# EasyEDA Pro project SDBlocker.eprj

# Schematic Schematic1
Board Name: Board1; Create Date: 2026-04-04; Page Name: P1; Project Name: SDBlocker; Schematic Name: Schematic1; Update Date: 2026-07-10; Company: EasyEDA.com; Page Size: A4; Version: V1.0
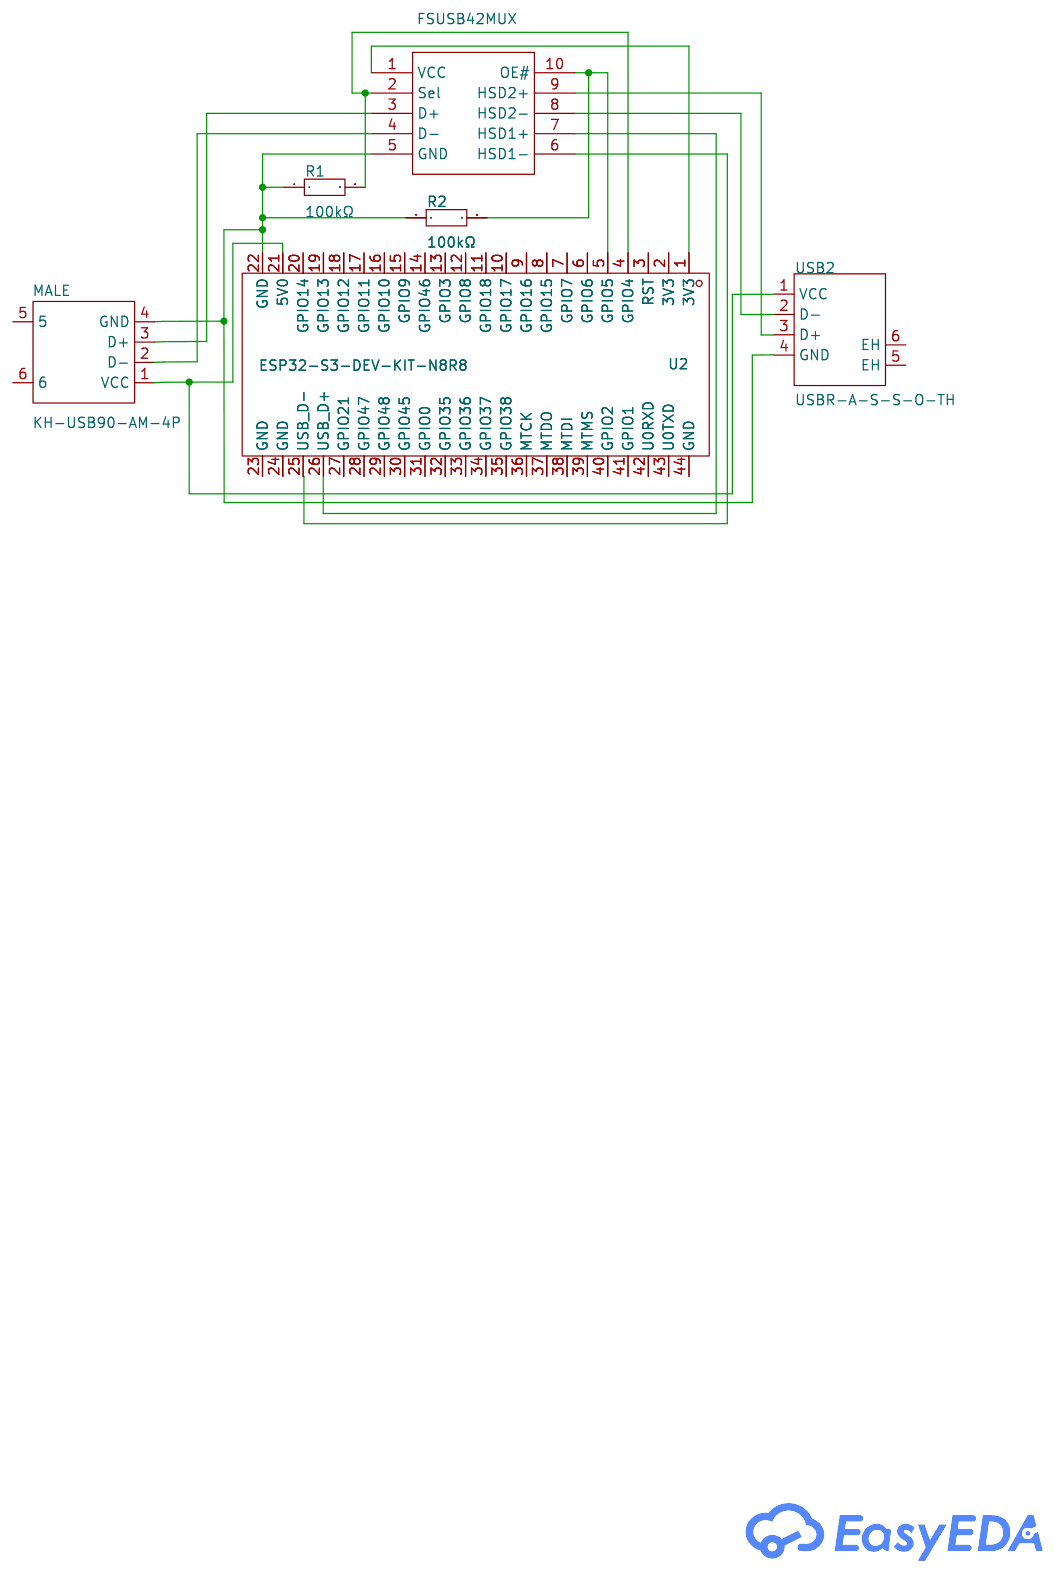
[diagram p0: schematic sheet]

## Parts
FSUSB42MUX  FSUSB42MUX  [MSOP-10_L3.0-W3.0-P0.50-LS5.0-BL]
MALE  KH-USB90-AM-4P  [USB-A-TH_917-181A202ED60201]
R1  100kΩ  [R1206]
R2  100kΩ  [R1206]
U2  ESP32-S3-DEV-KIT-N8R8  [COMM-TH_L63.3-W25.4-P2.54-LS22.86]
USB2  USBR-A-S-S-O-TH  [USB-TH_USBR-A-S-S-O-TH]

## Library data of the parts
FSUSB42MUX = FSUSB42MUX: Switch Circuit:2:1 Number of Channels:2 Ron:3.9Ω Voltage - Supply:3V~4.4V Voltage - Supply:3V~4.4V Con:3.7pF Turn-on time:13ns Turn-off time:12ns Bandwidth:720MHz Operating Temperature:-40℃~+85℃ Operating Temperature:-40℃~+85℃ Propagation Delay (tpd):250p; LCSC Part Name: 低功耗，双端口，高速USB2.0 (480Mbps) UART开关; Supplier Part: C11355; Manufacturer: onsemi(安森美); Supplier Footprint: MSOP-10; JLCPCB Part Class: Extended Part; Datasheet: https://item.szlcsc.com/datasheet/FSUSB42MUX/11908.html; Supplier: LCSC; Switch Circuit: 2:1; Number of Channels: 2; Supply Voltage: 3V~4.4V; Turn-on time: 13ns; On-State Resistance (Max): 6.5Ω; Turn-off time: 12ns; Operating Temperature: -40℃~+85℃; Ron: 3.9Ω; Voltage - Supply: 3V~4.4V; Con: 3.7pF; Bandwidth: 720MHz; Propagation Delay (tpd): 250ps; Features: Bidirectional analog channel；Fault protection
MALE = KH-USB90-AM-4P: Connector Type:Type-A Protocol Standard:USB 2.0 Gender:Male Mounting Type:Right Angle Number of Contacts:4P Number of Ports:1 Current Rating-Power:- Length:18.8mm Operating Temperature:- Operating Temperature:-; LCSC Part Name: Type-A 公 弯插; Supplier Part: C2828093; Manufacturer: kinghelm(金航标); Supplier Footprint: 弯插; JLCPCB Part Class: Extended Part; Datasheet: https://item.szlcsc.com/datasheet/KH-USB90-AM-4P/2975545.html; Supplier: LCSC; Connector Type: Type-A; Protocol Standard: USB 2.0; Gender: Male; Mounting Type: Right Angle; Number of Contacts: 4P; Number of Ports: 1; Length: 18.8mm
R1 R2 = CR1206J100KP05Z: Type:Thick Film Resistor Resistance:100kΩ Tolerance:±5% Tolerance:±5% Power(Watts):250mW Voltage-Supply(Max):200V Temperature Coefficient:±100ppm/℃ Temperature Coefficient:±100ppm/℃ Operating Temperature:-55℃~+155℃ Operating Temperature:-55℃~+155℃; LCSC Part Name: 厚膜电阻 100kΩ ±5% 250mW; Supplier Part: C881326; Manufacturer: EVER OHMS(天二科技); Supplier Footprint: 1206; JLCPCB Part Class: Extended Part; Datasheet: https://item.szlcsc.com/datasheet/CR1206J100KP05Z/944241.html; Supplier: LCSC; Type: Thick Film Resistor; Tolerance: ±5%; Power(Watts): 250mW; Voltage-Supply(Max): 200V; Temperature Coefficient: ±100ppm/℃; Operating Temperature: -55℃~+155℃
U2 = ESP32-S3-DEV-KIT-N8R8: Supplier Part: C9900170771; Supplier Footprint: SMD; Supplier: LCSC
USB2 = USBR-A-S-S-O-TH: LCSC Part Name: Type-A 母 弯插; Supplier Part: C3197997; Manufacturer: SAMTEC; Supplier Footprint: 插件; JLCPCB Part Class: Extended Part; Datasheet: https://item.szlcsc.com/datasheet/USBR-A-S-S-O-TH/3759758.html; Supplier: LCSC; Connector Type: Type-A; Protocol Standard: USB 2.0; Gender: Female; Mounting Type: Right Angle; Number of Contacts: 4P; Number of Ports: 1; Voltage Rating: 30V; Detection color: Orange; Operating Temperature: -50℃~+85℃

## Nets
$1N2770: FSUSB42MUX.3(D+) MALE.3(D+)
$1N2815: FSUSB42MUX.4(D-) MALE.2(D-)
$1N2926: FSUSB42MUX.1(VCC) U2.1(3V3)
$1N3122: FSUSB42MUX.6(HSD1-) U2.25(USB_D-)
$1N3580: FSUSB42MUX.2(Sel) R1.2 U2.4(GPIO4)
$1N3681: FSUSB42MUX.10(OE#) R2.2 U2.5(GPIO5)
Net-(FSUSB42MUX-5): FSUSB42MUX.5(GND) MALE.4(GND) R1.1 R2.1 U2.22(GND)

Not connected (* = marked no-connect by the designer): FSUSB42MUX 7(HSD1+) 8(HSD2-) 9(HSD2+); MALE 1(VCC) 5 6; U2 2(3V3) 3(RST) 6(GPIO6) 7(GPIO7) 8(GPIO15) 9(GPIO16) 10(GPIO17) 11(GPIO18) 12(GPIO8) 13(GPIO3) 14(GPIO46) 15(GPIO9) 16(GPIO10) 17(GPIO11) 18(GPIO12) 19(GPIO13) 20(GPIO14) 21(5V0) 23(GND) 24(GND) 26(USB_D+) 27(GPIO21) 28(GPIO47) 29(GPIO48) 30(GPIO45) 31(GPIO0) 32(GPIO35) 33(GPIO36) 34(GPIO37) 35(GPIO38) 36(MTCK) 37(MTDO) 38(MTDI) 39(MTMS) 40(GPIO2) 41(GPIO1) 42(U0RXD) 43(U0TXD) 44(GND); USB2 1(VCC) 2(D-) 3(D+) 4(GND) 5(EH) 6(EH)

# Board PCB1
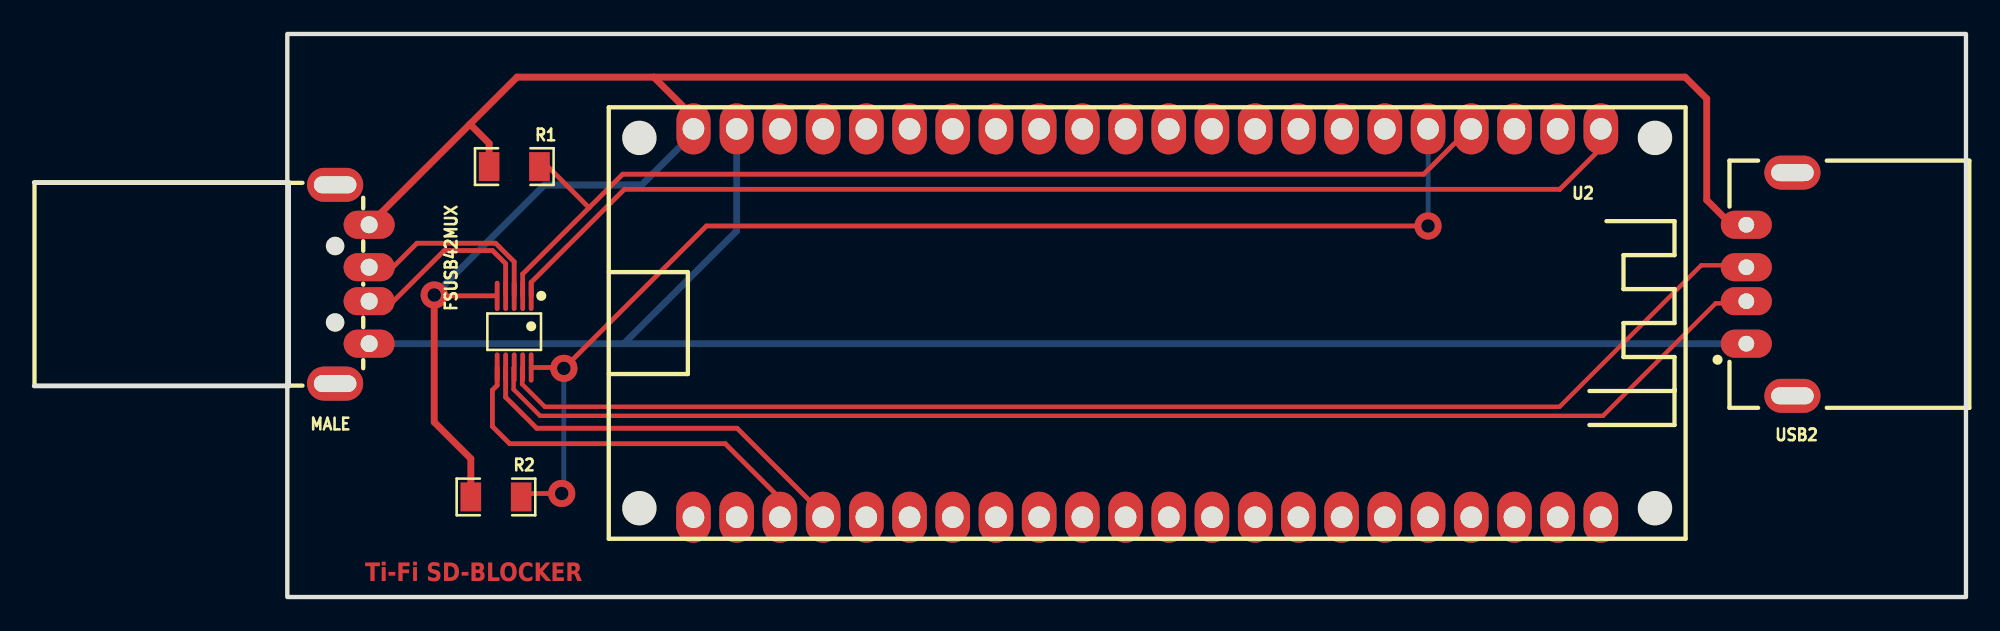
[diagram p1: board, top side]
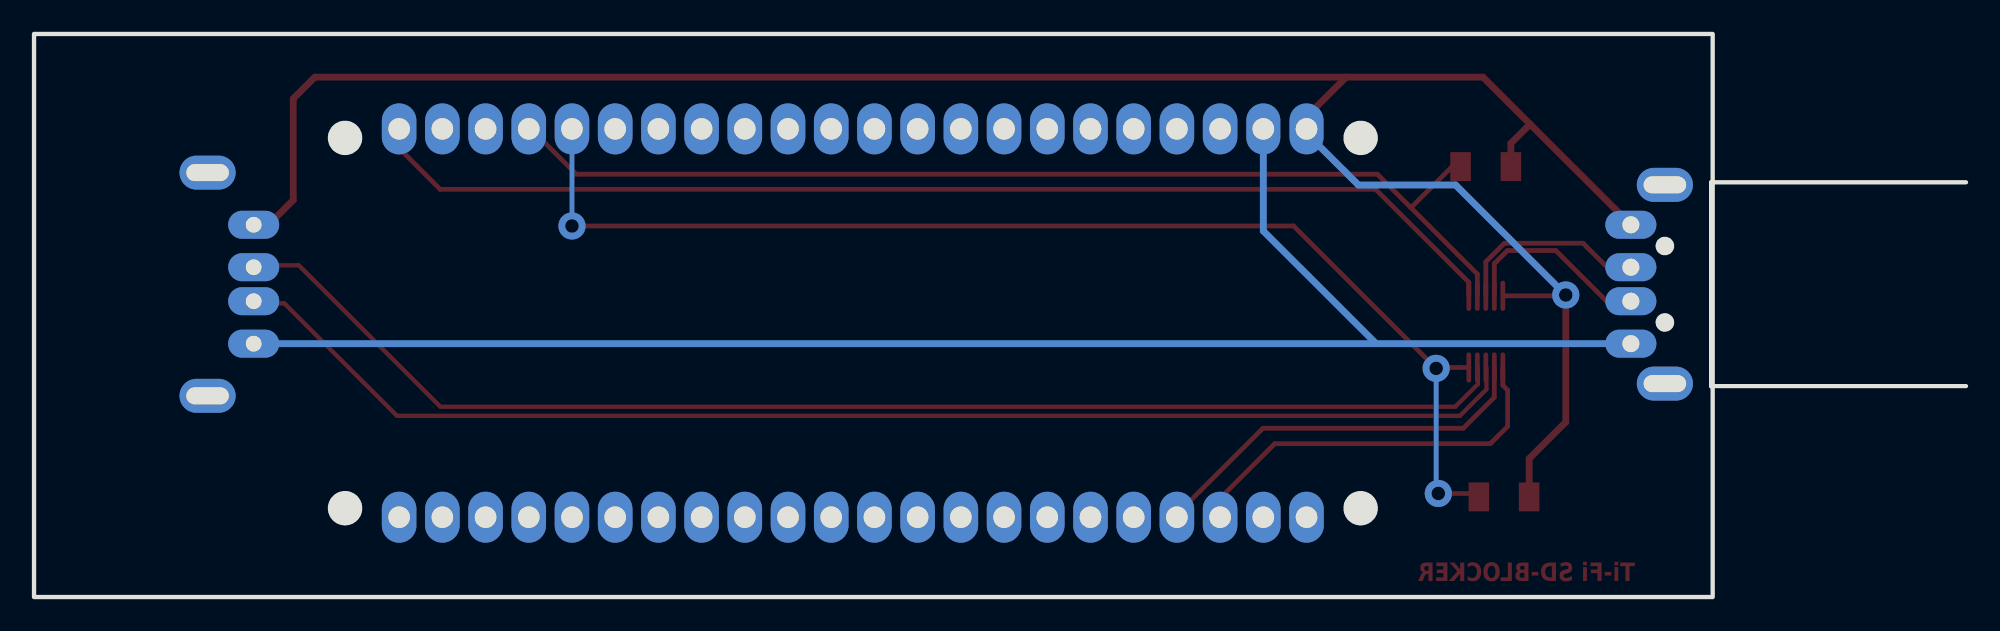
[diagram p2: board, bottom side, seen from below]

Outline 113.57 x 33.15 mm; copper layers: Top Layer, Bottom Layer. Coordinates in mm from the lower left corner of the outline.
Outline path: rectangle 14.89,33.15 113.57,0
Stack: Top Layer 0.035mm / Dielectric1 1.51mm FR4 er 4.5 / Bottom Layer 0.035mm

## Design rules (mm)
net $1N2770: DP1
net $1N2815: DP1
net $1N3095: DP3
net $1N3264: DP3
net $1N3111: DP2
net $1N3122: DP2
template: Custom Config
spacing copperThickness1oz (default): track to track 0.2, other pairs 0.2 to 0.2
spacing copperThickness2oz: track to track 0.203, other pairs 0.152 to 0.3
track width copperThickness1oz (default): min 0.127, default 0.254, max 2.54
track width copperThickness2oz: min 0.203, default 0.254, max 2.54
differential pair differentialPair (default): width min 0.127, default 0.254, max 2.54; gap min 0.152, default 0.152
via viaSize (default): diameter min 0.5, default 0.61, max 10; hole min 0.3, default 0.305, max 6.3

## Placement (name value [footprint] x y rotation side)
FSUSB42MUX  FSUSB42MUX  [MSOP-10_L3.0-W3.0-P0.50-LS5.0-BL]  28.22 15.62 180 top
MALE  KH-USB90-AM-4P  [USB-A-TH_917-181A202ED60201]  18.7 18.42 270 top
R1  100kΩ  [R1206]  28.23 25.34 0 top
R2  100kΩ  [R1206]  27.16 5.89 0 top
U2  ESP32-S3-DEV-KIT-N8R8  [COMM-TH_L63.3-W25.4-P2.54-LS22.86]  65.44 16.13 270 top
USB2  USBR-A-S-S-O-TH  [USB-TH_USBR-A-S-S-O-TH]  102.01 18.42 90 top

## Footprints (pads in the part's own frame, mm; a bottom-side part is the same pattern mirrored in y, then rotated)
COMM-TH_L63.3-W25.4-P2.54-LS22.86
  oval 3x2.032 hole 1.27: 1(-11.43,26.67) 2(-11.43,24.13) 3(-11.43,21.59) 4(-11.43,19.05) 5(-11.43,16.51) 6(-11.43,13.97) 7(-11.43,11.43) 8(-11.43,8.89) 9(-11.43,6.35) 10(-11.43,3.81) 11(-11.43,1.27) 12(-11.43,-1.27) 13(-11.43,-3.81) 14(-11.43,-6.35) 15(-11.43,-8.89) 16(-11.43,-11.43) 17(-11.43,-13.97) 18(-11.43,-16.51) 19(-11.43,-19.05) 20(-11.43,-21.59) 29(11.43,-11.43) 30(11.43,-8.89) 31(11.43,-6.35) 32(11.43,-3.81) 33(11.43,-1.27) 34(11.43,1.27) 35(11.43,3.81) 36(11.43,6.35) 37(11.43,8.89) 38(11.43,11.43) 39(11.43,13.97) 40(11.43,16.51) 41(11.43,19.05) 42(11.43,21.59) 43(11.43,24.13) 44(11.43,26.67)
  oval 3x2 hole 1.27: 21(-11.43,-24.13) 22(-11.43,-26.67)
  oval 3x2.032 hole 1.27x1.143: 23(11.43,-26.67) 24(11.43,-24.13) 25(11.43,-21.59) 26(11.43,-19.05) 27(11.43,-16.51) 28(11.43,-13.97)
MSOP-10_L3.0-W3.0-P0.50-LS5.0-BL
  oval 0.28x1.778 smd: 1(-1,-2.11) 2(-0.5,-2.11) 3(0,-2.11) 4(0.5,-2.11) 5(1,-2.11) 6(1,2.11) 7(0.5,2.11) 8(0,2.11) 9(-0.5,2.11) 10(-1,2.11)
R1206
  rect 1.208x1.701 smd: 1(-1.479,0) 2(1.479,0)
USB-A-TH_917-181A202ED60201
  oval 1.651x3 hole 1: 1(3.5,1) 2(1,1) 3(-1,1) 4(-3.5,1)
  oval 2x3.3 hole 1x2.5: 5(-5.85,-1) 6(5.85,-1)
USB-TH_USBR-A-S-S-O-TH
  oval 1.651x3 hole 0.925x0.92: 1(-3.5,1.355) 2(-1,1.355) 3(1,1.355) 4(3.5,1.355)
  oval 1.999x3.3 hole 1.001x2.499: 5(-6.57,-1.355) 6(6.57,-1.355)

## Nets
$1N2770: FSUSB42MUX.3 MALE.3
$1N2815: FSUSB42MUX.4 MALE.2
$1N2863: MALE.1 U2.21 USB2.1
$1N2926: FSUSB42MUX.1 U2.1
$1N3095: FSUSB42MUX.8 USB2.2
$1N3111: FSUSB42MUX.7 U2.26
$1N3122: FSUSB42MUX.6 U2.25
$1N3264: FSUSB42MUX.9 USB2.3
$1N3580: FSUSB42MUX.2 R1.2 U2.4
$1N3681: FSUSB42MUX.10 R2.2 U2.5
$1N5589: FSUSB42MUX.5 MALE.4 R1.1 R2.1 U2.22 USB2.4

Pads without a net: MALE 5 6; U2 2 3 6 7 8 9 10 11 12 13 14 15 16 17 18 19 20 23 24 27 28 29 30 31 32 33 34 35 36 37 38 39 40 41 42 43 44; USB2 5 6

## Via types
v1: diameter 1.6, hole 0.8, Top Layer to Bottom Layer, 4 vias

## Routing (per net, layer and track width the routed paths; a pad name or vN(x,y) marks a point on that pad's centre or on a via; arc(x,y) is an arc through that point)
$1N2770: length 11.6
  Top Layer w0.28: MALE.3 21.1,19.42 22.51,20.83 27.13,20.83 28.22,19.74 FSUSB42MUX.3
$1N2815: length 11.5
  Top Layer w0.28: FSUSB42MUX.4 27.72,19.63 26.95,20.4 24.11,20.4 21.13,17.42 MALE.2
$1N2863: length 96.3
  Bottom Layer w0.399: 34.67,14.92 USB2.1 ; 34.67,14.92 41.31,21.55 U2.21 ; 34.67,14.92 MALE.1
$1N2926: length 68.1
  Top Layer w0.28: FSUSB42MUX.1 29.22,18.53 34.7,24 89.69,24 92.11,26.42 U2.1
$1N3095: length 77.2
  Top Layer w0.254: FSUSB42MUX.8 28.19,13.48 28.19,12.23 29.75,10.67 92.23,10.67 98.85,17.29 99.51,17.29 99.64,17.42 USB2.2
$1N3111: length 23.4
  Top Layer w0.28: U2.26 46.39,4.88 41.33,9.93 29.55,9.93 27.72,11.76 FSUSB42MUX.7
$1N3122: length 23.5
  Top Layer w0.28: U2.25 43.98,4.84 43.98,5.68 40.63,9.03 27.96,9.03 26.95,10.04 26.95,12.18 27.22,12.46 FSUSB42MUX.6
$1N3264: length 77
  Top Layer w0.254: USB2.3 100.54,19.53 98,19.53 89.68,11.2 30.03,11.2 28.69,12.53 28.69,13.48 FSUSB42MUX.9
$1N3580: length 64.5
  Top Layer w0.28: 32.63,22.92 28.72,19.02 FSUSB42MUX.2 ; 32.63,22.92 34.6,24.89 81.69,24.89 84.36,27.56 U2.4 ; 32.63,22.92 30.21,25.34 R1.2
$1N3681: length 71.1
  Top Layer w0.28: FSUSB42MUX.10 31.1,13.51 v1(31.15,13.46) 39.53,21.84 v1(81.95,21.84) ; v1(31.02,6.1) 29.23,6.1
  Bottom Layer w0.28: v1(31.02,6.1) 31.15,6.22 v1(31.15,13.46) ; v1(81.95,21.84) U2.5
$1N5589: length 134.5
  Top Layer w0.28: 27.14,17.73 23.58,17.73 v1(23.53,17.78)
  Top Layer w0.399: U2.22 38.77,28.27 36.43,30.61 ; 36.43,30.61 97.06,30.61 98.33,29.34 98.33,23.37 99.78,21.92 USB2.4 ; 36.43,30.61 28.39,30.61 25.62,27.84 ; R1.1 26.75,26.71 25.62,27.84 ; 25.62,27.84 MALE.4
  Top Layer w0.4: R2.1 25.68,8.14 23.53,10.3 v1(23.53,17.78)
  Bottom Layer w0.4: v1(23.53,17.78) 30,24.26 35.72,24.26 38.77,27.31 U2.22

## Copper pours and planes (outline as drawn; the poured copper is in the pictures)
(no net) on Top Layer: 17.33,31.84 17.29,32.02 17.22,32.18 17.12,32.33 17,32.46 16.85,32.56 16.68,32.63 16.5,32.66 16.32,32.66 16.15,32.63 15.98,32.56 15.83,32.46 15.71,32.33 15.61,32.18 15.54,32.02 15.5,31.84 15.5,31.66 15.54,31.48 15.61,31.32 15.71,31.17 15.83,31.04 15.98,30.94 16.15,30.87 16.32,30.84 16.5,30.84 16.68,30.87 16.85,30.94 17,31.04 17.12,31.17 17.22,31.32 17.29,31.48 17.33,31.66

## Text on the board
Top Layer: Ti-Fi SD-BLOCKER
